# EAGLE schematic t44_PWM (EAGLE 9.1.0)
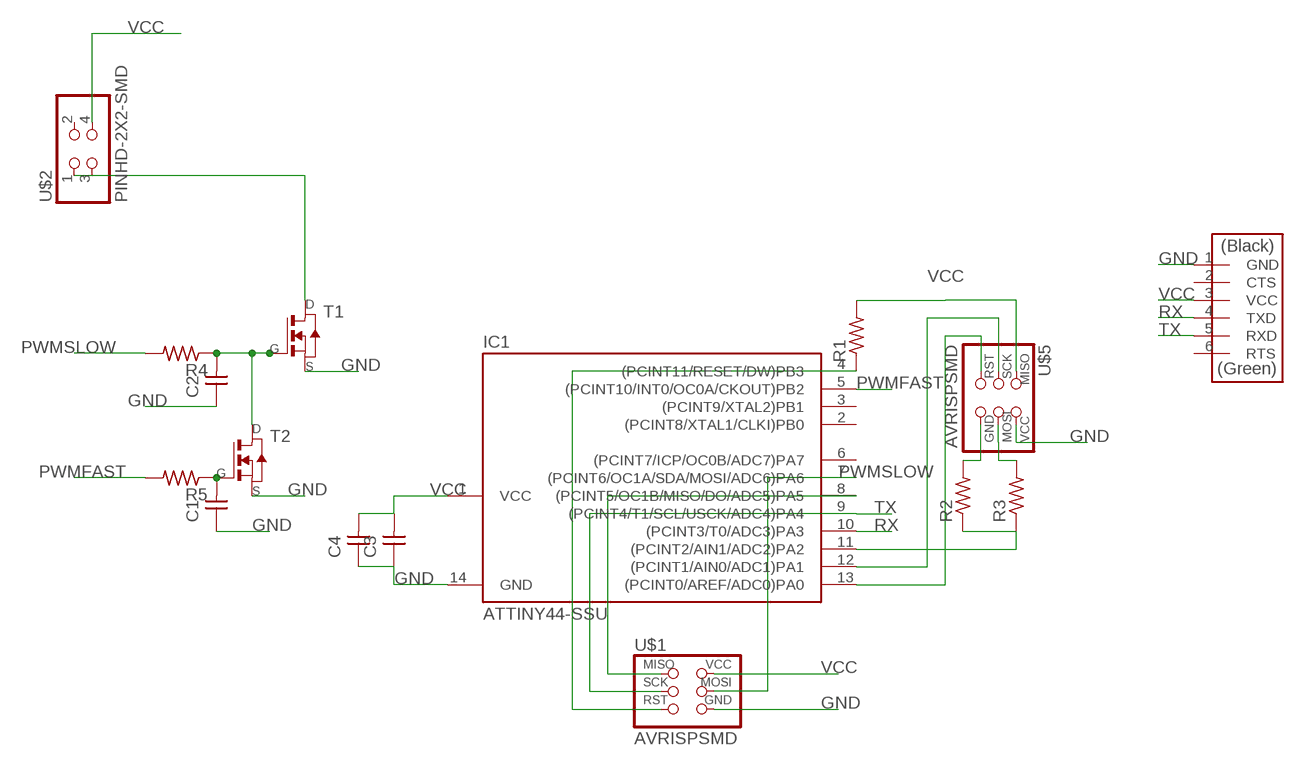
[diagram p0: schematic, sheet 1]

## Parts
C1  CAP-UNPOLARIZED  [C1206]
C2  CAP-UNPOLARIZED  [C1206]
C3  CAP-UNPOLARIZED  [C1206]
C4  CAP-UNPOLARIZED  [C1206]
IC1  ATTINY44-SSU  [SOIC14]
R1  RES-US1206  [R1206]
R2  RES-US1206  [R1206]
R3  RES-US1206  [R1206]
R4  RES-US1206  [R1206]
R5  RES-US1206  [R1206]
T1  NMOSFETSOT23  [SOT-23]
T2  NMOSFETSOT23  [SOT-23]
U$1  AVRISPSMD  [2X03SMD]
U$2  PINHD-2X2-SMD  [2X02SMD]
U$4  FTDI-SMD-HEADER  [1X06SMD]
U$5  AVRISPSMD  [2X03SMD]

## Nets
GND: C1.1 C2.1 C3.1 C4.1 IC1.14(GND) T1.2(S) T2.2(S) U$1.6(GND) U$4.1(GND) U$5.2(VCC)
N$1: C2.2 R4.1 T1.3(G) T2.1(D)
N$2: R2.2 U$5.6(GND)
N$3: IC1.8((PCINT5/OC1B/MISO/DO/ADC5)PA5) U$1.1(MISO)
N$5: IC1.4((PCINT11/RESET/DW)PB3) R1.1 U$1.5(RST)
N$6: C1.2 R5.1 T2.3(G)
N$7: R3.2 U$5.4(MOSI)
N$8: T1.1(D) U$2.1 U$2.3
N$11: IC1.13((PCINT0/AREF/ADC0)PA0) U$5.5(RST)
N$12: IC1.12((PCINT1/AIN0/ADC1)PA1) U$5.3(SCK)
N$13: IC1.11((PCINT2/AIN1/ADC2)PA2) R2.1 R3.1
PWMFAST: IC1.5((PCINT10/INT0/OC0A/CKOUT)PB2) R5.2
PWMSLOW: IC1.7((PCINT6/OC1A/SDA/MOSI/ADC6)PA6) R4.2 U$1.4(MOSI)
RX: IC1.10((PCINT3/T0/ADC3)PA3) U$4.4(TXD)
TX: IC1.9((PCINT4/T1/SCL/USCK/ADC4)PA4) U$1.3(SCK) U$4.5(RXD)
VCC: C3.2 C4.2 IC1.1(VCC) R1.2 U$1.2(VCC) U$2.4 U$4.3(VCC) U$5.1(MISO)
Unconnected: IC1.2((PCINT8/XTAL1/CLKI)PB0) IC1.3((PCINT9/XTAL2)PB1) IC1.6((PCINT7/ICP/OC0B/ADC7)PA7) U$2.2 U$4.2(CTS) U$4.6(RTS)

## Library data of the parts
C1-C4 = fab:CAP-UNPOLARIZED
IC1 = fabcopy:ATTINY44
R1-R5 = fabcopy:RES-US: Resistor (US Symbol) Variants with postfix FAB are widened to allow the routing of internal traces
T1 T2 = fab:NMOSFET: MOS FET
U$1 = fabcopy:AVRISP
U$2 = fabcopy:PINHD-2X2-SMD
U$4 = fab:FTDI-SMD-HEADER
U$5 = fab:AVRISP